# EAGLE design eii-psu-psb (EAGLE 9.6.2)
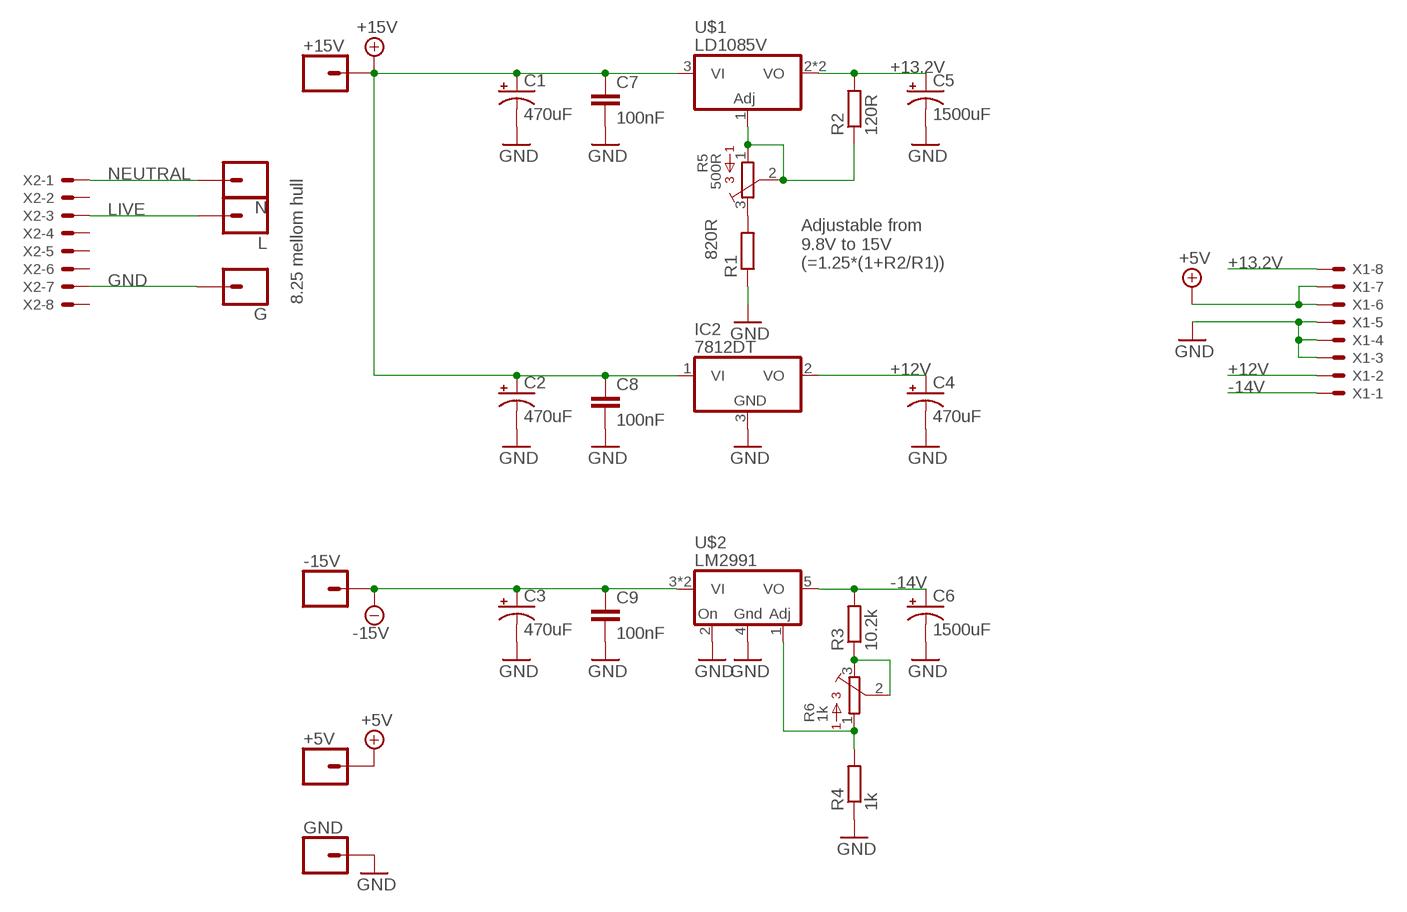
[diagram p0: schematic, sheet 1]

## Parts
+5V  CONN_01PTH_2MM  [1X01_2MM]
+15V  CONN_01PTH_2MM  [1X01_2MM]
-15V  CONN_01PTH_2MM  [1X01_2MM]
C1  470uF  CPOL-USE5-10.5  [E5-10,5]
C2  470uF  CPOL-USE5-10.5  [E5-10,5]
C3  470uF  CPOL-USE5-10.5  [E5-10,5]
C4  470uF  CPOL-USE5-10.5  [E5-10,5]
C5  1500uF  CPOL-USE5-13  [E5-13]
C6  1500uF  CPOL-USE5-13  [E5-13]
C7  100nF  C-EU050-030X075  [C050-030X075]
C8  100nF  C-EU050-030X075  [C050-030X075]
C9  100nF  C-EU050-030X075  [C050-030X075]
G  CONN_01PTH_2MM  [1X01_2MM]
GND  CONN_01PTH_2MM  [1X01_2MM]
IC2  7812DT  [TO252]
L  CONN_01PTH_2MM  [1X01_2MM]
N  CONN_01PTH_2MM  [1X01_2MM]
R1  820R  R-EU_R1206  [R1206]
R2  120R  R-EU_R1206  [R1206]
R3  10.2k  R-EU_R1206  [R1206]
R4  1k  R-EU_R1206  [R1206]
R5  500R  3362P  [3362P]
R6  1k  3362P  [3362P]
U$1  LD1085V  [TO263-3J]
U$2  LM2991  [TO263-5J]
X1  KK-156-8  [KK-156-8]
X2  KK-156-8  [KK-156-8]

## Nets
+5V: +5V.1 X1.6 X1.7
+12V: C4.+ IC2.2(VO) X1.2
+13.2V: C5.+ R2.2 U$1.2(VO) U$1.TAB(VO) X1.8
+15V: +15V.1 C1.+ C2.+ C7.1 C8.1 IC2.1(VI) U$1.3(VI)
-14V: C6.+ R3.2 U$2.5(VO) X1.1
-15V: -15V.1 C3.+ C9.1 U$2.3(VI) U$2.6(VI)
GND: C1.- C2.- C3.- C4.- C5.- C6.- C7.2 C8.2 C9.2 G.1 GND.1 IC2.3(GND) R1.1 R4.1 U$2.2(ON) U$2.4(GND) X1.3 X1.4 X1.5 X2.7
LIVE: L.1 X2.3
N$1: R1.2 R5.3
N$2: R2.1 R5.1 R5.2 U$1.1(ADJ)
N$5: R3.1 R6.2 R6.3
N$6: R4.2 R6.1 U$2.1(ADJ)
NEUTRAL: N.1 X2.1
Unconnected: X2.2 X2.4 X2.5 X2.6 X2.8

## Notes on the sheet
- Adjustable from
  9.8V to 15V
  (=1.25*(1+R2/R1))
- 8.25 mellom hull

## Library data of the parts
+5V +15V -15V G GND L N = SparkFun-Connectors:CONN_01: Single connection point. Often used as Generic Header-pin footprint for 0.1 inch spaced/style header connections On any of the 0.1 inch spaced packages, you can populate with these: Break Away Headers - Straight <https://www.sparkfun.com/products/116> (PRT-00116) Break Away Male Headers - Right Angle <https://www.sparkfun.com/products/553> (PRT-00553) Female Headers <https://www.sparkfun.com/products/115> (PRT-00115) Break Away Headers - Machine Pin <https://www.sparkfun.com/products/117> (PRT-00117) Break Away Female Headers - Swiss Machine Pin <https://www.sparkfun.com/products/743> (PRT-00743) This device is also useful as a general connection point to wire up your design to another part of your project. Our various solder wires solder well into these plated through hole pads. Hook-Up Wire - Assortment (Stranded, 22 AWG) <https://www.sparkfun.com/products/11375> (PRT-11375) Hook-Up Wire - Assortment (Solid Core, 22 AWG) <https://www.sparkfun.com/products/11367> (PRT-11367) View the entire wire category on our website here <https://www.sparkfun.com/categories/141> Special notes: SMTSO-256-ET is a "flush mount" nut for a 4-40 screw. We mostly use this on specialty testbeds; it is a nice way to connect hardware to your PCB at an adjustable hieght. Also note, the SNAP packages are for using a snappable style connector. We sell a baggie of snaps and they are also used on two LilyPad designs: Snap Assortment - 30 pack (male and female) <https://www.sparkfun.com/products/11347> (DEV-11347) LilyPad Arduino SimpleSnap <https://www.sparkfun.com/products/10941> (DEV-10941) LilyPad SimpleSnap Protoboard <https://www.sparkfun.com/products/10940> (DEV-10940)
C1-C6 = rcl:CPOL-US: POLARIZED CAPACITOR, American symbol; SPICEPREFIX: C
C7-C9 = rcl:C-EU: CAPACITOR, European symbol; SPICEPREFIX: C
IC2 = linear:78*: Positive VOLTAGE REGULATOR Source: http://cache.national.com/ds/LM/LM78L05.pdf http://www.fairchildsemi.com/ds/LM/LM7805.pdf
R1-R4 = rcl:R-EU_: RESISTOR, European symbol; SPICEPREFIX: R
R5 R6 = bourns:3362: 3362 Series 1/4" Square Trimmer
U$1 = joakim:LD1085V
U$2 = joakim:LM2991
X1 X2 = con-molex:KK-156-8: KK 156 HEADER Source: http://www.molex.com/pdm_docs/sd/026604100_sd.pdf; MF: MOLEX; OC_FARNELL: unknown; OC_NEWARK: unknown

## Board
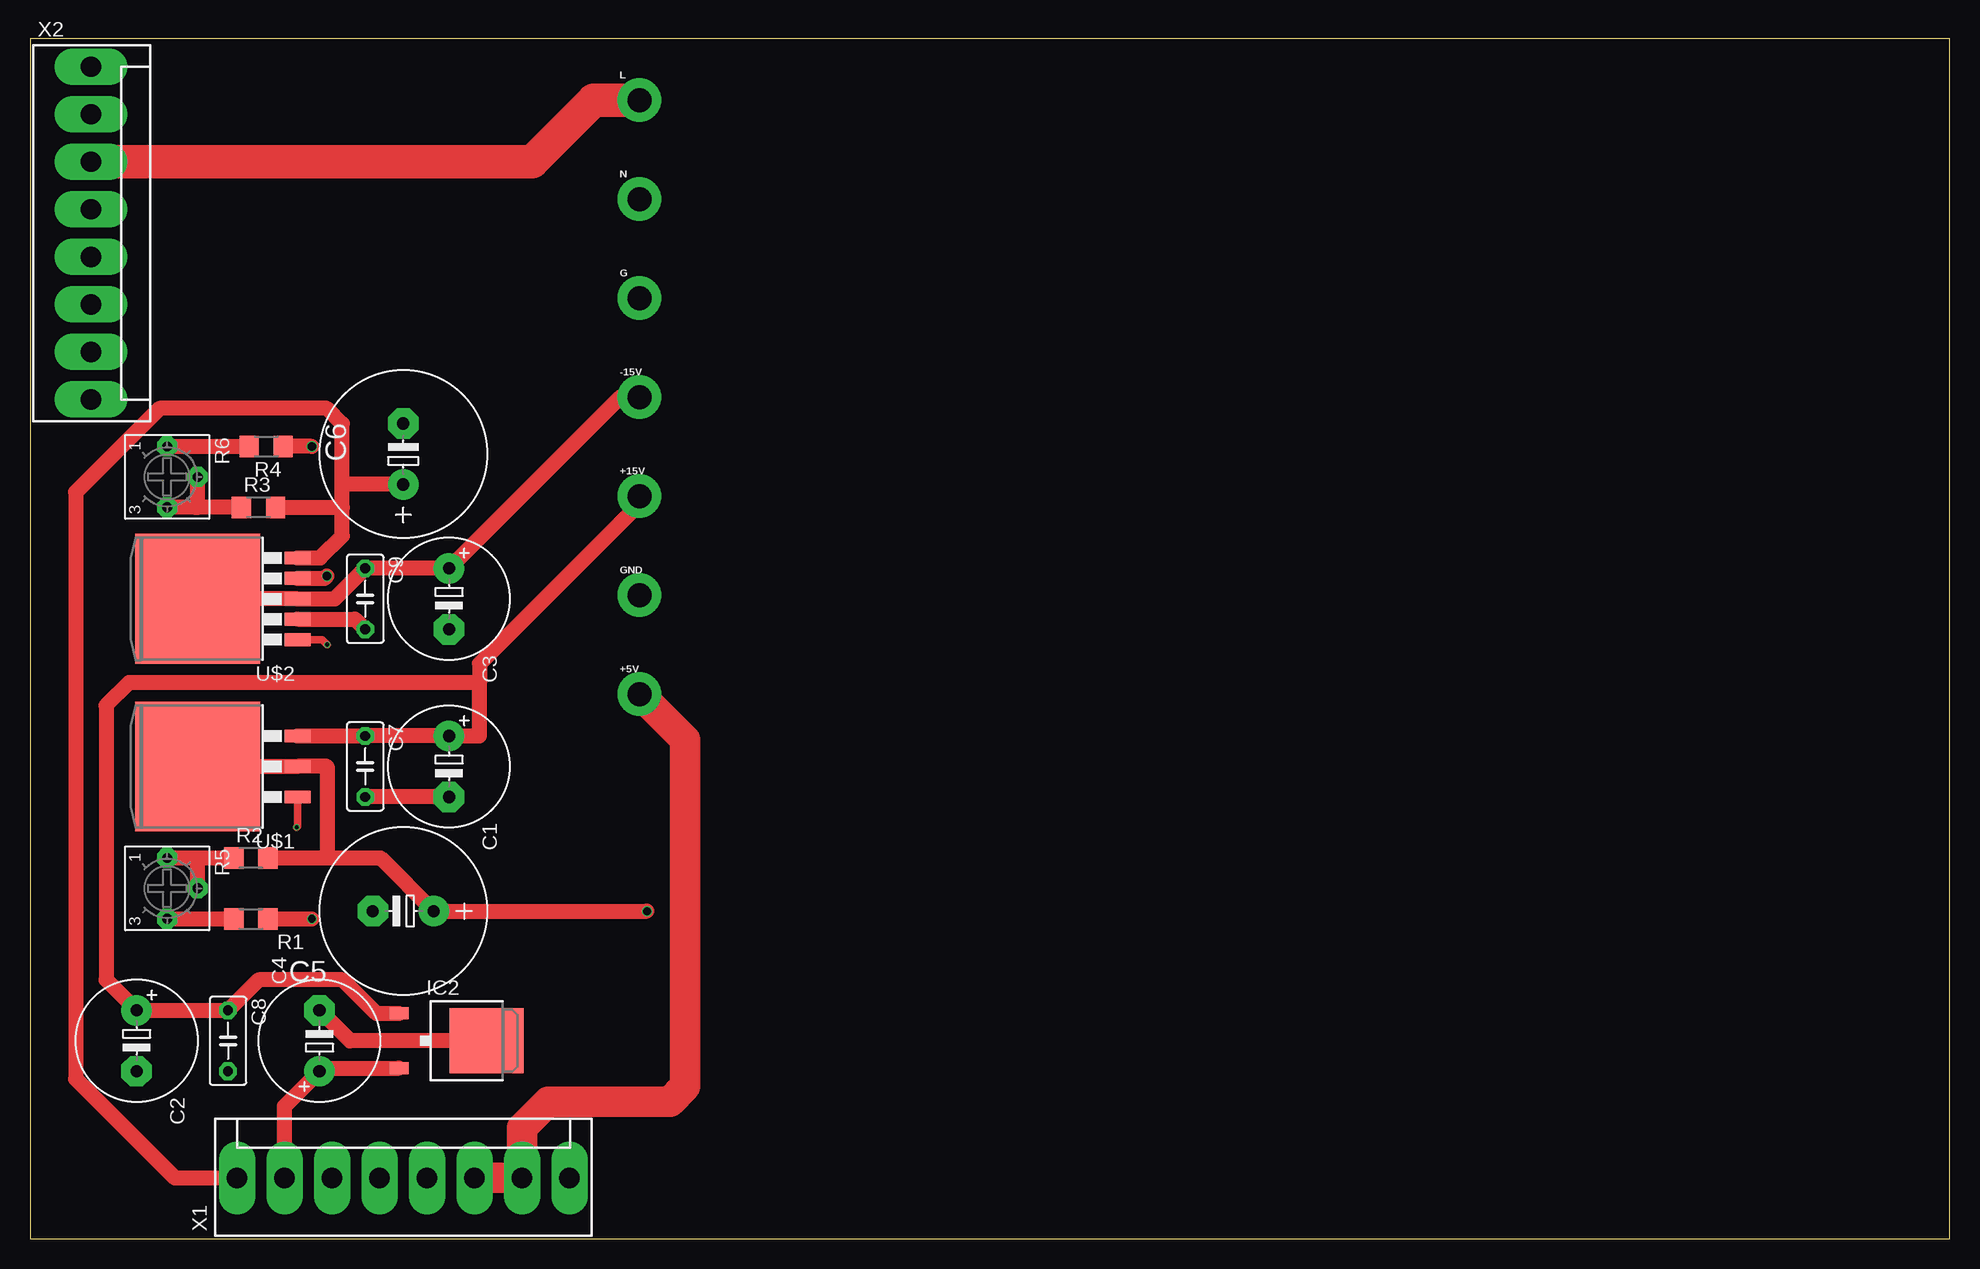
[diagram p1: board, top side]
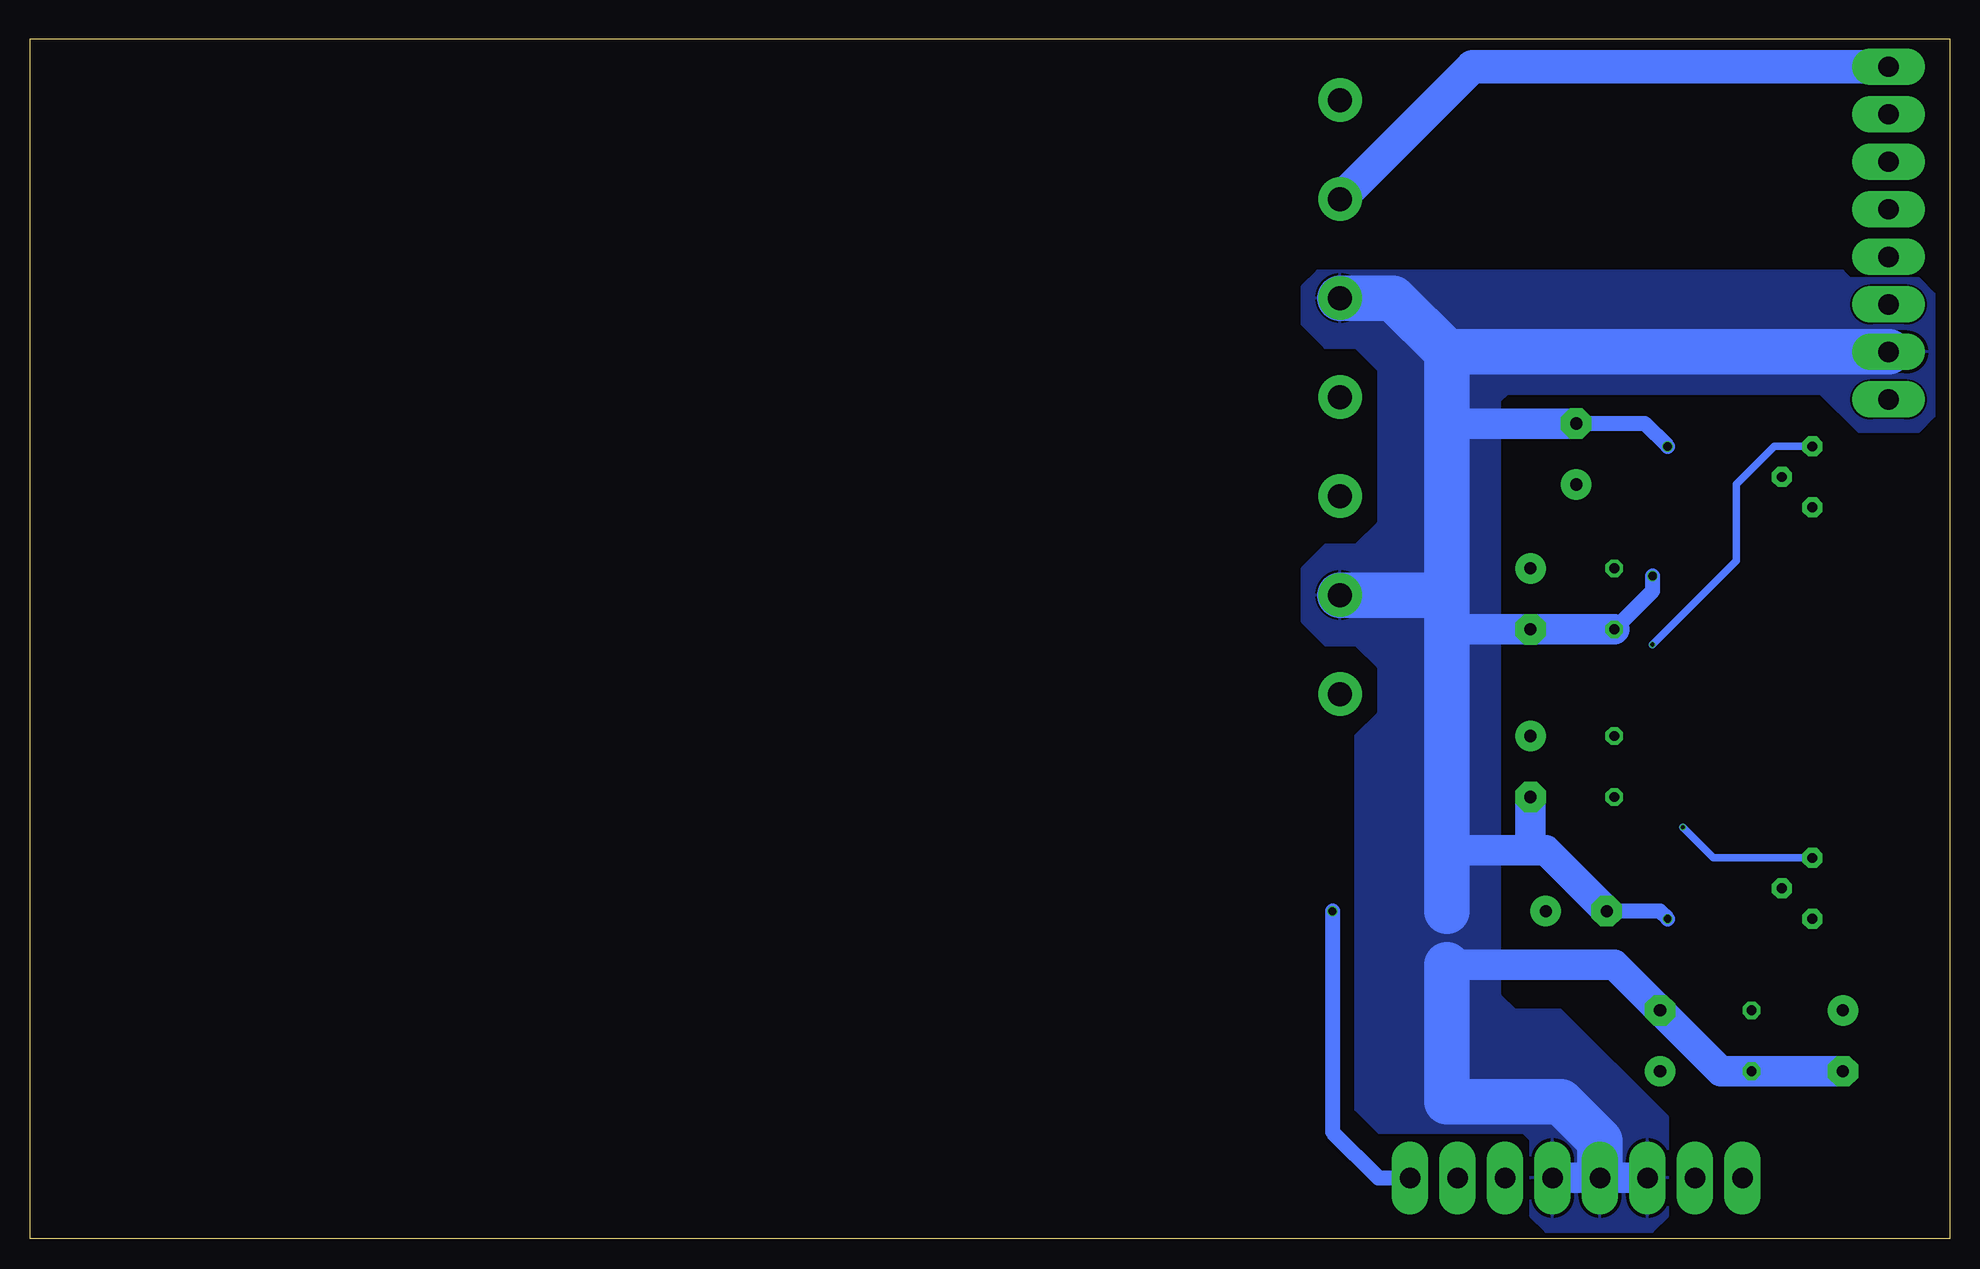
[diagram p2: board, bottom side, seen from below]

Size 160 x 100 mm. Coordinates in mm from the lower left corner, seen from the top.
Outline: 0,0 160,0 160,100 0,100 0,0
Copper layers (1*16): Top 0.035mm / dielectric 1.6mm / Bottom 0.035mm
Design rules "jlcpcb-2layers": minimum track width 5mil, minimum drill 0.3mm, track to track 5mil, track to pad 5mil, pad to pad 5mil, via to via 5mil, smd to smd 5mil, copper to edge 0.2mm, drill to drill 6mil, minimum pad ring 10mil, minimum via ring 3mil, stop-mask expansion 4mil, vias tented up to drill 0mil, thermal gap 10mil

### Footprints (pad centres in the part's own frame; a part is rotated, then mirrored left to right if it is on the bottom)
1X01_2MM = drill 2 pad 3.302: 1 0,0
E5-10,5 = drill 1.016 pad 2.54: + -2.54,0 | drill 1.016 pad 2.54 octagon: - 2.54,0
E5-13 = drill 1.016 pad 2.54: + -2.54,0 | drill 1.016 pad 2.54 octagon: - 2.54,0
C050-030X075 = drill 0.813 octagon: 1 -2.54,0; 2 2.54,0
TO252 = smd 1 x 1.6: 1 -2.28,-4.8; 2 2.28,-4.8 | smd 5.4 x 6.2: 3 0,2.5
R1206 = smd 1.6 x 1.803: 1 -1.422,0; 2 1.422,0
3362P = drill 0.813 pad 1.676 octagon: 1 -2.54,0; 2 0,2.54; 3 2.54,0
TO263-3J = smd 1.067 x 2.159: 1 -2.54,-5.791; 2 0,-5.791; 3 2.54,-5.791 | smd 10.8 x 10.41: TAB 0,2.54
TO263-5J = smd 1.067 x 2.159: 1 -3.404,-5.791; 2 -1.702,-5.791; 3 0,-5.791; 4 1.702,-5.791; 5 3.404,-5.791 | smd 10.8 x 10.41: 6 0,2.54
KK-156-8 = drill 1.7 pad 2.184 long: 1 -13.86,0; 2 -9.9,0; 3 -5.94,0; 4 -1.98,0; 5 1.98,0; 6 5.94,0; 7 9.9,0; 8 13.86,0

### Placement (x,y rotation side)
+5V  50.8,45.4 0 top
+15V  50.8,61.9 0 top
-15V  50.8,70.15 0 top
C1  34.92,39.37 270 top
C2  8.89,16.51 270 top
C3  34.92,53.34 270 top
C4  24.13,16.51 90 top
C5  31.11,27.3 180 top
C6  31.11,65.41 90 top
C7  27.94,39.37 270 top
C8  16.51,16.51 270 top
C9  27.94,53.34 270 top
G  50.8,78.4 0 top
GND  50.8,53.65 0 top
IC2  35.56,16.51 270 top
L  50.8,94.9 0 top
N  50.8,86.65 0 top
R1  18.41,26.67 180 top
R2  18.41,31.75 0 top
R3  19.05,60.96 0 top
R4  19.68,66.04 180 top
R5  11.43,29.21 270 top
R6  11.43,63.5 270 top
U$1  16.51,39.37 90 top
U$2  16.51,53.34 90 top
X1  31.11,5.08 0 top
X2  5.08,83.82 270 top

### Tracks (layer width: path | path; a pad name or v marks a point on that pad's centre or on a via)
+5V
  Top 2.54: X1.6 X1.7 | +5V.1 54.61,41.59 54.61,12.7 53.34,11.43 43.18,11.43 41.02,9.27 X1.7 | X1.7 41.02,6.72
+12V
  Top 1.27: 21.2,5.1 X1.2 21.21,11.05 C4.+ 24.39,14.23 IC2.2
+13.2V  (via drill 0.65)
  Top 1.27: R2.2 24.77,31.75 | 24.77,31.75 24.77,39.37 U$1.2 U$1.TAB | 24.77,31.75 29.21,31.75 C5.+ v51.44,27.3
  Bottom 1.27: X1.8 47.62,5.08 51.44,8.89 v51.44,27.3
+15V
  Top 1.27: IC2.1 28.86,18.79 26.05,21.59 19.05,21.59 C8.1 C2.+ 6.35,21.59 6.35,44.45 8.26,46.35 37.47,46.35 | U$1.3 C7.1 C1.+ 37.47,41.91 37.47,46.35 | +15V.1 50.8,61.27 37.47,47.93 37.47,46.35
-14V
  Top 1.27: U$2.5 24.21,56.74 26.04,58.57 26.04,60.96 | R3.2 26.04,60.96 | 26.04,60.96 26.04,62.87 | 26.04,62.87 26.04,67.94 24.77,69.22 10.79,69.22 3.81,62.23 3.81,13.34 12.06,5.08 X1.1 | C6.+ 26.04,62.87
-15V
  Top 1.27: U$2.6 U$2.3 25.4,53.34 C9.1 C3.+ 49.2,70.15 -15V.1
GND  (via drill 0.65, 0.7)
  Top 1.27: C1.- C7.2 | U$2.2 27.1,51.64 C9.2 | R1.1 v23.5,26.67 | U$2.4 24.56,55.04 v24.77,55.24 | v23.5,66.04 R4.1 | C4.- 26.67,16.51 IC2.3
  Bottom 1.27: v24.77,55.24 24.77,53.98 C9.2 | v23.5,26.67 24.13,27.3 C5.- | v23.5,66.04 25.4,67.94 C6.-
  Bottom 2.54: X1.3 X1.4 X1.5 | 41.91,33.02 41.27,32.38 34.92,32.38 | 34.92,32.38 33.66,32.38 C5.- | C1.- 34.92,32.38 | C2.- C8.2 19.05,13.97 C4.- 27.94,22.86 41.91,22.86 | C9.2 C3.- 41.91,50.8 | C6.- 41.91,67.94
  Bottom 3.81: X1.4 29.14,8.18 32.38,11.43 41.91,11.43 41.91,22.86 | 41.91,27.3 41.91,33.02 41.91,50.8 41.91,54.61 | 41.91,54.61 41.91,67.94 41.91,73.92 | X2.7 41.91,73.92 | 41.91,73.92 46.39,78.4 G.1 | GND.1 42.87,53.65 41.91,54.61
  pour Bottom: 23.5,1.91 23.5,10.16 32.38,19.05 36.2,19.05 37.47,20.32 37.47,69.85 36.83,70.48 10.79,70.48 7.62,67.31 2.54,67.31 1.27,68.58 1.27,78.74 2.54,80.01 8.26,80.01 8.89,80.64 52.7,80.64 53.98,79.38 53.98,76.2 52.07,74.3 49.53,74.3 47.62,72.39 47.62,59.69 49.53,57.78 52.07,57.78 53.98,55.88 53.98,51.44 52.07,49.53 49.53,49.53 47.62,47.62 47.62,43.81 49.53,41.91 49.53,10.79 47.62,8.89 35.56,8.89 34.92,8.26 34.92,1.91 33.66,0.64 24.77,0.64
LIVE
  Top 2.794: X2.3 41.85,89.76 46.99,94.9 L.1
N$1
  Top 1.27: R5.3 13.97,26.67 16.51,26.67 R1.2
N$2  (via drill 0.35)
  Top 0.635: U$1.1 22.3,34.37 v22.23,34.29
  Top 1.27: R5.1 13.97,31.75 | 13.97,31.75 R2.1 | R5.2 13.97,31.75
  Bottom 0.635: v22.23,34.29 19.68,31.75 R5.1
N$5
  Top 1.27: R6.3 13.78,60.96 13.97,61.14 | 13.97,61.14 R6.2 | 13.97,61.14 13.97,60.96 R3.1
N$6  (via drill 0.35)
  Top 0.635: U$2.1 24.36,49.94 v24.77,49.53
  Top 1.27: R6.1 R4.2
  Bottom 0.635: v24.77,49.53 17.78,56.52 17.78,62.87 14.61,66.04 R6.1
NEUTRAL
  Bottom 2.794: X2.1 39.77,97.68 N.1